# EAGLE design ADL5390board (EAGLE 9.6.2)
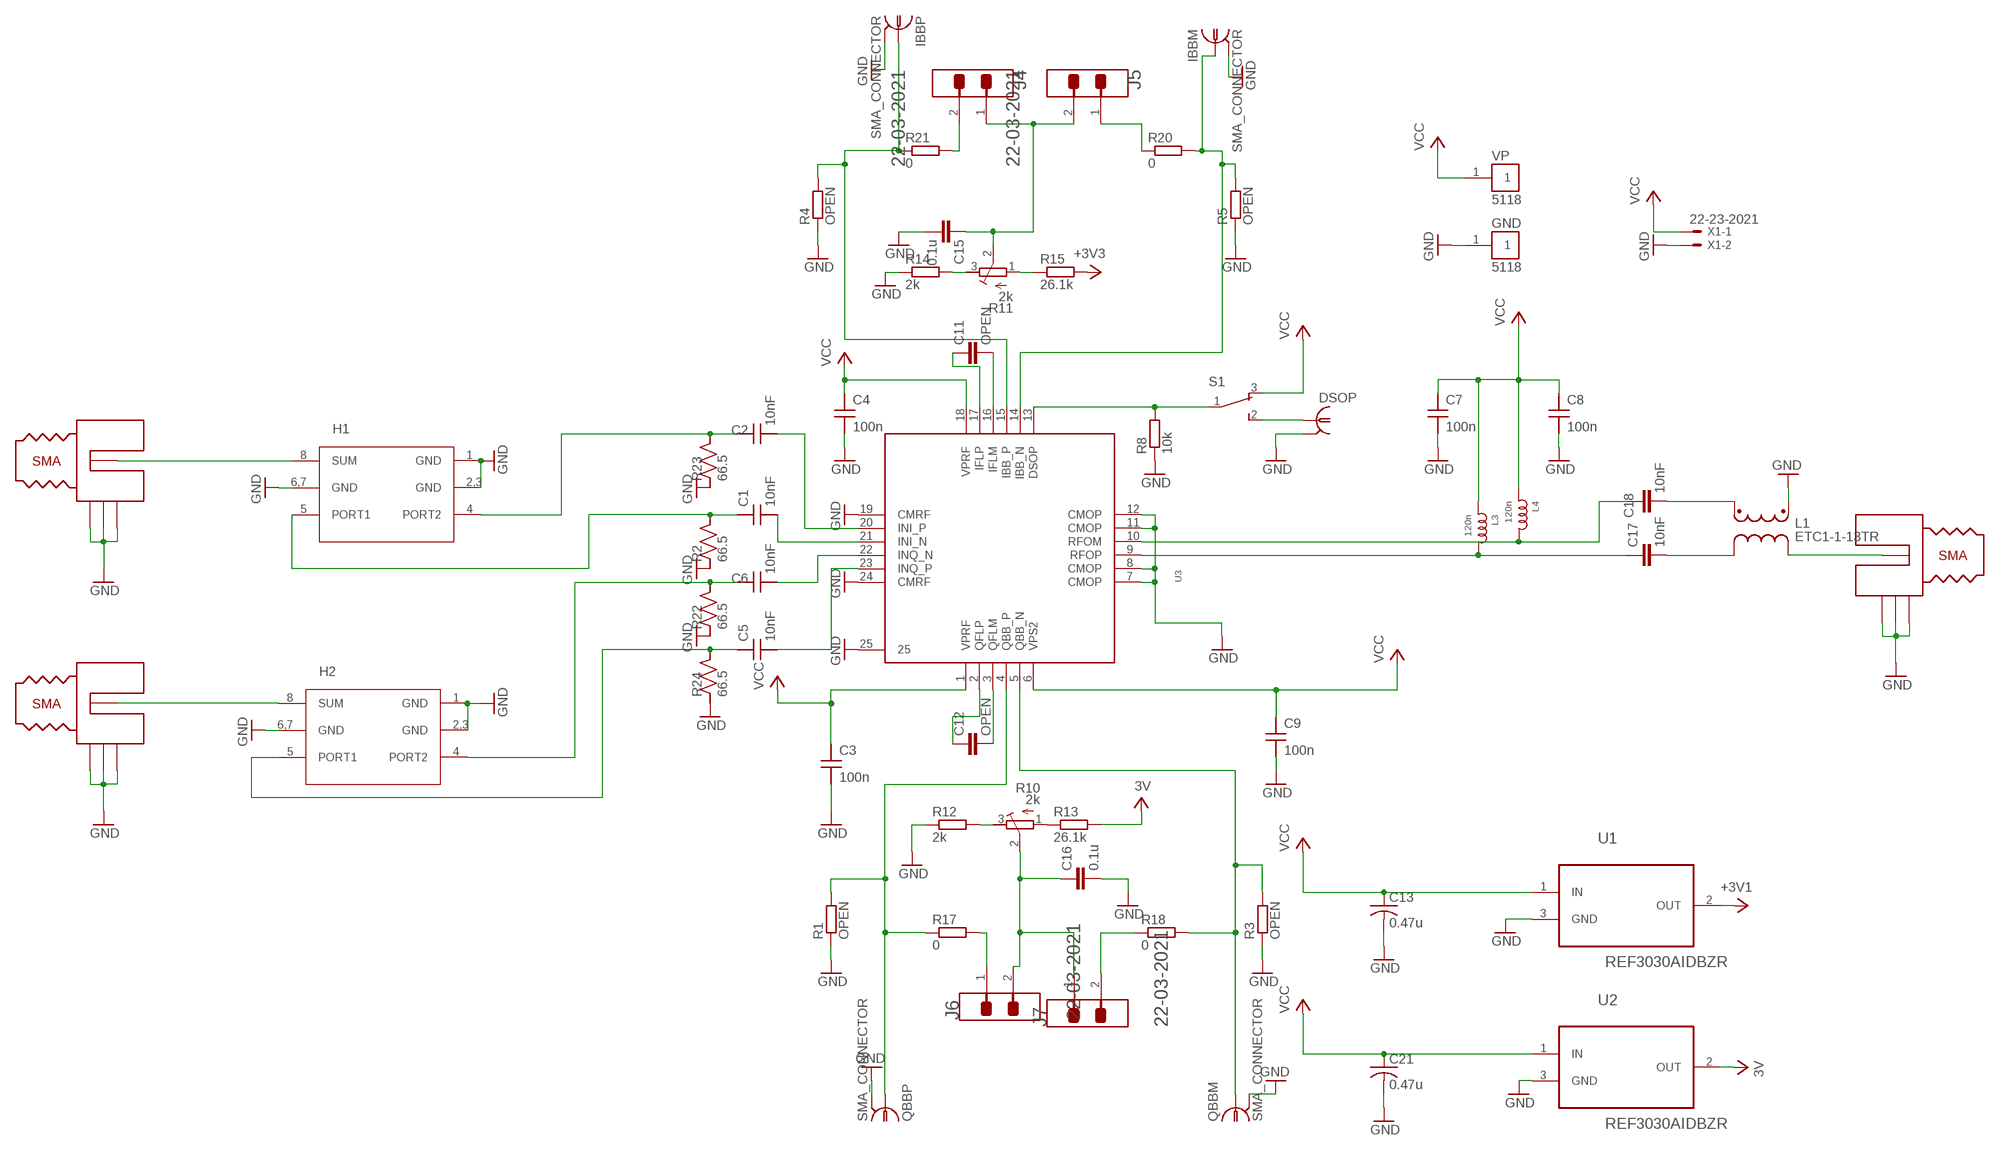
[diagram p0: schematic, sheet 1]

## Parts
C1  10nF  C_MLCC_SMDCMLCC_0402  [C_MLCC_0402]
C2  10nF  C_MLCC_SMDCMLCC_0402  [C_MLCC_0402]
C3  100n  C_MLCC_SMDCMLCC_0204  [C_MLCC_0204]
C4  100n  C_MLCC_SMDCMLCC_0204  [C_MLCC_0204]
C5  10nF  C_MLCC_SMDCMLCC_0402  [C_MLCC_0402]
C6  10nF  C_MLCC_SMDCMLCC_0402  [C_MLCC_0402]
C7  100n  C_MLCC_SMDCMLCC_0204  [C_MLCC_0204]
C8  100n  C_MLCC_SMDCMLCC_0204  [C_MLCC_0204]
C9  100n  C_MLCC_SMDCMLCC_0204  [C_MLCC_0204]
C11  OPEN  C-EUC0603  [C0603]
C12  OPEN  C-EUC0603  [C0603]
C13  0.47u  C-USC0603  [C0603]
C15  0.1u  C-EUC0603  [C0603]
C16  0.1u  C-EUC0603  [C0603]
C17  10nF  C-EUC0402  [C0402]
C18  10nF  C-EUC0402  [C0402]
C21  0.47u  C-USC0603  [C0603]
DSOP  SMA_CONNECTOR  [QKDLAB_JOSH_MECHANICAL_JOHNSON_SMA_EDGE_LAUNCH_142-0701-851]
GND  5118  [TP_5118]
H1  SYPJ-2-33+  [PL-274]
H2  SYPJ-2-33+  [PL-274]
IBBM  SMA_CONNECTOR  [QKDLAB_JOSH_MECHANICAL_JOHNSON_SMA_EDGE_LAUNCH_142-0701-851]
IBBP  SMA_CONNECTOR  [QKDLAB_JOSH_MECHANICAL_JOHNSON_SMA_EDGE_LAUNCH_142-0701-851]
J1  QKDLAB_JOSH_MECHANICAL_JOHNSON_SMA_18GHZ_142-0761-891  [QKDLAB_JOSH_MECHANICAL_JOHNSON_SMA_18GHZ_4-LAYER_142-0761-891]
J2  QKDLAB_JOSH_MECHANICAL_JOHNSON_SMA_18GHZ_142-0761-891  [QKDLAB_JOSH_MECHANICAL_JOHNSON_SMA_18GHZ_4-LAYER_142-0761-891]
J3  QKDLAB_JOSH_MECHANICAL_JOHNSON_SMA_18GHZ_142-0761-891  [QKDLAB_JOSH_MECHANICAL_JOHNSON_SMA_18GHZ_4-LAYER_142-0761-891]
J4  MOLEX_22-03-2021MOLEX_22-03-2021_0_0  [MOLEX_22-03-2021_0]
J5  MOLEX_22-03-2021MOLEX_22-03-2021_0_0  [MOLEX_22-03-2021_0]
J6  MOLEX_22-03-2021MOLEX_22-03-2021_0_0  [MOLEX_22-03-2021_0]
J7  MOLEX_22-03-2021MOLEX_22-03-2021_0_0  [MOLEX_22-03-2021_0]
L1  ETC1-1-13TR  [SM22]
L3  120n  L_0603  [R0603]
L4  120n  L_0603  [R0603]
QBBM  SMA_CONNECTOR  [QKDLAB_JOSH_MECHANICAL_JOHNSON_SMA_EDGE_LAUNCH_142-0701-851]
QBBP  SMA_CONNECTOR  [QKDLAB_JOSH_MECHANICAL_JOHNSON_SMA_EDGE_LAUNCH_142-0701-851]
R1  OPEN  R-EU_R0603  [R0603]
R2  66.5  R_SMDR0402  [R_0402]
R3  OPEN  R-EU_R0603  [R0603]
R4  OPEN  R-EU_R0603  [R0603]
R5  OPEN  R-EU_R0603  [R0603]
R8  10k  R-EU_R0603  [R0603]
R10  2k  R-TRIMM3296W  [RTRIM3296W]
R11  2k  R-TRIMM3296W  [RTRIM3296W]
R12  2k  R-EU_R0603  [R0603]
R13  26.1k  R-EU_R0603  [R0603]
R14  2k  R-EU_R0603  [R0603]
R15  26.1k  R-EU_R0603  [R0603]
R17  0  R-EU_R0603  [R0603]
R18  0  R-EU_R0603  [R0603]
R20  0  R-EU_R0603  [R0603]
R21  0  R-EU_R0603  [R0603]
R22  66.5  R_SMDR0402  [R_0402]
R23  66.5  R_SMDR0402  [R_0402]
R24  66.5  R_SMDR0402  [R_0402]
S1  450301014042  [450301014042]
U1  REF3030AIDBZR  [SOT95P237X112-3N]
U2  REF3030AIDBZR  [SOT95P237X112-3N]
U3  ADL5390_ADL5390  [ADL5390_ADL5390]
VP  5118  [TP_5118]
X1  22-23-2021  [22-23-2021]

## Nets
+3V3: R15.2 U1.2(OUT) ; supply symbol labelled +3V1
DSOP [CHIP_PIN]: R8.2 S1.1 U3.13(DSOP)
GND: C3.P$2 C4.P$2 C7.P$2 C8.P$2 C9.P$2 C13.2 C15.2 C16.2 C21.2 DSOP.P$2 DSOP.P$3 DSOP.P$4 DSOP.P$5 GND.1 H1.1(GND) H1.2,3(GND) H1.6,7(GND) H2.1(GND) H2.2,3(GND) H2.6,7(GND) IBBM.P$2 IBBM.P$3 IBBM.P$4 IBBM.P$5 IBBP.P$2 IBBP.P$3 IBBP.P$4 IBBP.P$5 J1.P$2(GND) J1.P$3(GND) J1.P$4(GND) J2.P$2(GND) J2.P$3(GND) J2.P$4(GND) J3.P$2(GND) J3.P$3(GND) J3.P$4(GND) L1.1 QBBM.P$2 QBBM.P$3 QBBM.P$4 QBBM.P$5 QBBP.P$2 QBBP.P$3 QBBP.P$4 QBBP.P$5 R1.1 R2.P$1 R3.1 R4.1 R5.1 R8.1 R12.1 R14.1 R22.P$1 R23.P$1 R24.P$1 U1.3(GND) U2.3(GND) U3.7(CMOP) U3.8(CMOP) U3.11(CMOP) U3.12(CMOP) U3.19(CMRF) U3.24(CMRF) U3.25 X1.2
IBB_N [CHIP_PIN]: IBBM.P$1 R5.2 R20.2 U3.14(IBB_N)
IBB_P [CHIP_PIN]: IBBP.P$1 R4.2 R21.1 U3.15(IBB_P)
IFL_N [CHIP_PIN]: C11.2 U3.16(IFLM)
IFL_P [CHIP_PIN]: C11.1 U3.17(IFLP)
IN_N: H2.8(SUM) J2.P$1(SIG)
IN_P: H1.8(SUM) J1.P$1(SIG)
INI_N [CHIP_PIN]: C1.P$2 U3.21(INI_N)
INI_P [CHIP_PIN]: C2.P$2 U3.20(INI_P)
INQ_N [CHIP_PIN]: C6.P$2 U3.22(INQ_N)
INQ_P [CHIP_PIN]: C5.P$2 U3.23(INQ_P)
N$1: R11.1(A) R15.1
N$2: R11.3(E) R14.2
N$3: C15.1 J4.1 J5.2 R11.2(S)
N$5: J4.2 R21.2
N$8: J5.1 R20.1
N$9: J6.1 R17.2
N$11: J7.2 R18.1
N$13: C16.1 J6.2 J7.1 R10.2(S)
N$15: R10.3(E) R12.2
N$16: R10.1(A) R13.1
N$20: C18.2 L1.5
N$21: C17.2 L1.4
N$22: J3.P$1(SIG) L1.3
N$24: DSOP.P$1 S1.2
QBB_N [CHIP_PIN]: QBBM.P$1 R3.2 R18.2 U3.5(QBB_N)
QBB_P [CHIP_PIN]: QBBP.P$1 R1.2 R17.1 U3.4(QBB_P)
QFL_N [CHIP_PIN]: C12.2 U3.3(QFLM)
QFL_P [CHIP_PIN]: C12.1 U3.2(QFLP)
RFINI_N [Differential]: C1.P$1 H1.5(PORT1) R2.P$2
RFINI_P [Differential]: C2.P$1 H1.4(PORT2) R23.P$2
RFINQ_N [Differential]: C6.P$1 H2.4(PORT2) R22.P$2
RFINQ_P [Differential]: C5.P$1 H2.5(PORT1) R24.P$2
RFO_N [RFOUT]: C18.1 L4.2 U3.10(RFOM)
RFO_P [RFOUT]: C17.1 L3.2 U3.9(RFOP)
V+: R13.2 U2.2(OUT) ; supply symbol labelled 3V
VCC: C3.P$1 C4.P$1 C7.P$1 C8.P$1 C9.P$1 C13.1 C21.1 L3.1 L4.1 S1.3 U1.1(IN) U2.1(IN) U3.1(VPRF) U3.6(VPS2) U3.18(VPRF) VP.1 X1.1

## Library data of the parts
C1 C2 C5 C6 = jqi_passives:C_MLCC_SMD; DIGIKEY: 445-6846-1-ND; PARTNO: C1005C0G1H102J050BA
C3 C4 C7-C9 = jqi_passives:C_MLCC_SMD; DIGIKEY: 587-5138-1-ND; PARTNO: EWK105C6104MPHF
C11 C12 = rcl:C-EU: CAPACITOR, European symbol; SPICEPREFIX: C
C13 C21 = rcl:C-US: CAPACITOR, American symbol; DIGIKEY: 1276-2082-1-ND; PARTNO: CL10B474KA8NFNC; SPICEPREFIX: C
C15 C16 = rcl:C-EU: CAPACITOR, European symbol; DIGIKEY: 1276-1006-1-ND; PARTNO: CL10B104KA8NNNC; SPICEPREFIX: C
C17 C18 = rcl:C-EU: CAPACITOR, European symbol; DIGIKEY: 445-6846-1-ND; PARTNO: C1005C0G1H102J050BA; SPICEPREFIX: C
DSOP = SMA_connectors:SMA_CONNECTOR
GND = 5118:5118: Gray PC Test Point, Miniature Phosphor Bronze, Silver Plating 0.040" (1.02mm) Hole Diameter Mounting Type Check prices <https://pricing.snapeda.com/search/part/5118/?ref=eda>; AVAILABILITY: Warning; DESCRIPTION: 18µH Shielded Wirewound Inductor 7.5A 22mOhm Nonstandard; DIGIKEY: 36-5118-ND; MF: Keystone Electronics; MP: 5118; PACKAGE: Package; PARTNO: 5118; PRICE: None; PURCHASE-URL: https://pricing.snapeda.com/search/part/5118/?ref=eda
H1 H2 = MiniCircuits_TTC:SYPJ-2-33+
IBBM IBBP QBBM QBBP = SMA_connectors:SMA_CONNECTOR; DIGIKEY: J658-ND
J1-J3 = SMA_connectors:QKDLAB_JOSH_MECHANICAL_JOHNSON_SMA_18GHZ_142-0761-891: Emerson 142-0761-891 High Frequency SMA End Launch Connector; DIGIKEY: ARF2499-ND; PARTNO: 901-10511-2
J4-J7 = Molex - 22-03-2021:MOLEX_22-03-2021: KK® 254 Wire-to-Board Header, Single Row, Vertical, 2 Circuits, PA Polyamide Nylon, Tin (Sn) Plating; CENTROID_NOT_SPECIFIED: No; CONTACT_TYPE: Male Pin; DATASHEET: http://www.molex.com/pdm_docs/sd/022032021_sd.pdf; DIGIKEY_DESCRIPTION: CONN HEADER 2POS .100 VERT TIN; DIGIKEY_PART_NUMBER: WM4000-ND; LEAD_FREE: yes; MF: Molex; MOUSER_PART_NUMBER: 538-22-03-2021; MPN: 22-03-2021; NUMBER_OF_POSITIONS: 2; NUMBER_OF_ROWS: 1; PACKAGE: HDR2; PITCH_-_MATING: 0.100" (2.54mm); PREFIX: J; ROHS: yes; TEMPERATURE_RANGE_HIGH: +80°C; TEMPERATURE_RANGE_LOW: -40°C; VOLTAGE: 250V
L1 = ETC1-1-13TR:ETC1-1-13TR: RF 1:1 Transmission Line Transformer 4.5 - 3000 MHz; AVAILABILITY: Unavailable; DESCRIPTION: RF Balun 4.5MHz ~ 3GHz 1:1 5-SMD; DIGIKEY: 1465-1217-1-ND; MF: M/A-Com Technology; MP: ETC1-1-13TR; PACKAGE: SMD-5 MA-COM; PRICE: None
L3 L4 = Inductor_TC:L_0603; DIGIKEY: 490-LQW18ASR12G0CDCT-ND; PARTNO: LQW18ASR12G0CD
R1 R3-R5 R17 R18 R20 R21 = rcl:R-EU_: RESISTOR, European symbol; DIGIKEY: 541-0.0GCT-ND; PARTNO: CRCW06030000Z0EA; SPICEPREFIX: R
R2 R22-R24 = jqi_passives:R_SMD; DIGIKEY: P66.5LDKR-ND; PARTNO: ERJ-2RKF66R5X
R8 = rcl:R-EU_: RESISTOR, European symbol; DIGIKEY: P10KDBCT-ND; PARTNO: ERA-3AEB103V; SPICEPREFIX: R
R10 R11 = rcl:R-TRIMM: Trimm resistor; DIGIKEY: 490-2880-ND; PARTNO: PV36W202C01B00; SPICEMODEL: X; SPICEPREFIXL: POT
R12 R14 = rcl:R-EU_: RESISTOR, European symbol; DIGIKEY: P2.0KDBCT-ND; PARTNO: ERA-3AEB202V; SPICEPREFIX: R
R13 R15 = rcl:R-EU_: RESISTOR, European symbol; DIGIKEY: P26.1KDBCT-ND; PARTNO: ERA-3AEB2612V; SPICEPREFIX: R
S1 = 450301014042:450301014042: 10x2.5 mm THT WS-SLTV <http://katalog.we-online.de/media/images/v2/Family_WS-SLTV_THT_Mini_Slide_Switch_450301014042.jpg> Details see: http://katalog.we-online.de/en/em/SLTV_10X2_5_THT 2015 (C) Wurth Elektronik Check prices <https://pricing.snapeda.com/search/part/450301014042/?ref=eda>; AVAILABILITY: Warning; DESCRIPTION: Slide Switch SPDT Through Hole; DIGIKEY: 450301014042-ND; MF: Wurth Electronics; MP: 450301014042; PACKAGE: None; PRICE: None; PURCHASE-URL: https://pricing.snapeda.com/search/part/450301014042/?ref=eda
U1 U2 = REF3030AIDBZR:REF3030AIDBZR: CMOS VOLTAGE REFERENCE; DESCRIPTION: 3-V, 50-ppm/C, 50-A in 3-pin SOT-23 package series (bandgap) voltage reference 3-SOT-23 -40 to 125; DIGI-KEY_PART_NUMBER: 296-26323-1-ND; MF: Texas Instruments; MP: REF3030AIDBZR; PACKAGE: SOT-23-3 Texas Instruments; PURCHASE-URL: https://pricing.snapeda.com/search/part/REF3030AIDBZR/?ref=eda
U3 = ADL5390board:ADL5390_ADL5390; DIGIKEY: ADL5390ACPZ-REEL7CT-ND; PARTNO: ADL5390ACPZ-REEL7
VP = 5118:5118: Gray PC Test Point, Miniature Phosphor Bronze, Silver Plating 0.040" (1.02mm) Hole Diameter Mounting Type Check prices <https://pricing.snapeda.com/search/part/5118/?ref=eda>; AVAILABILITY: Warning; DESCRIPTION: 18µH Shielded Wirewound Inductor 7.5A 22mOhm Nonstandard; DIGIKEY: 36-5000-ND; MF: Keystone Electronics; MP: 5118; PACKAGE: Package; PARTNO: 5000; PRICE: None; PURCHASE-URL: https://pricing.snapeda.com/search/part/5118/?ref=eda
X1 = con-molex:22-23-2021: .100" (2.54mm) Center Header - 2 Pin; MF: MOLEX; MPN: 22-23-2021; OC_FARNELL: 1462926; OC_NEWARK: 25C3832

## Net classes
0 default: width 0.127 mm, clearance 0.152 mm
1 Differential: width 0.127 mm, drill 0.254 mm, clearance 0.254 mm to class 0, clearance 0.127 mm
2 CHIP_PIN: clearance 0.254 mm to class 0, clearance 0.127 mm to class 1, clearance 0.127 mm
3 RFOUT: clearance 0.127 mm to class 0, clearance 0.127 mm to class 1, clearance 0.127 mm to class 2, clearance 0.254 mm

## Board
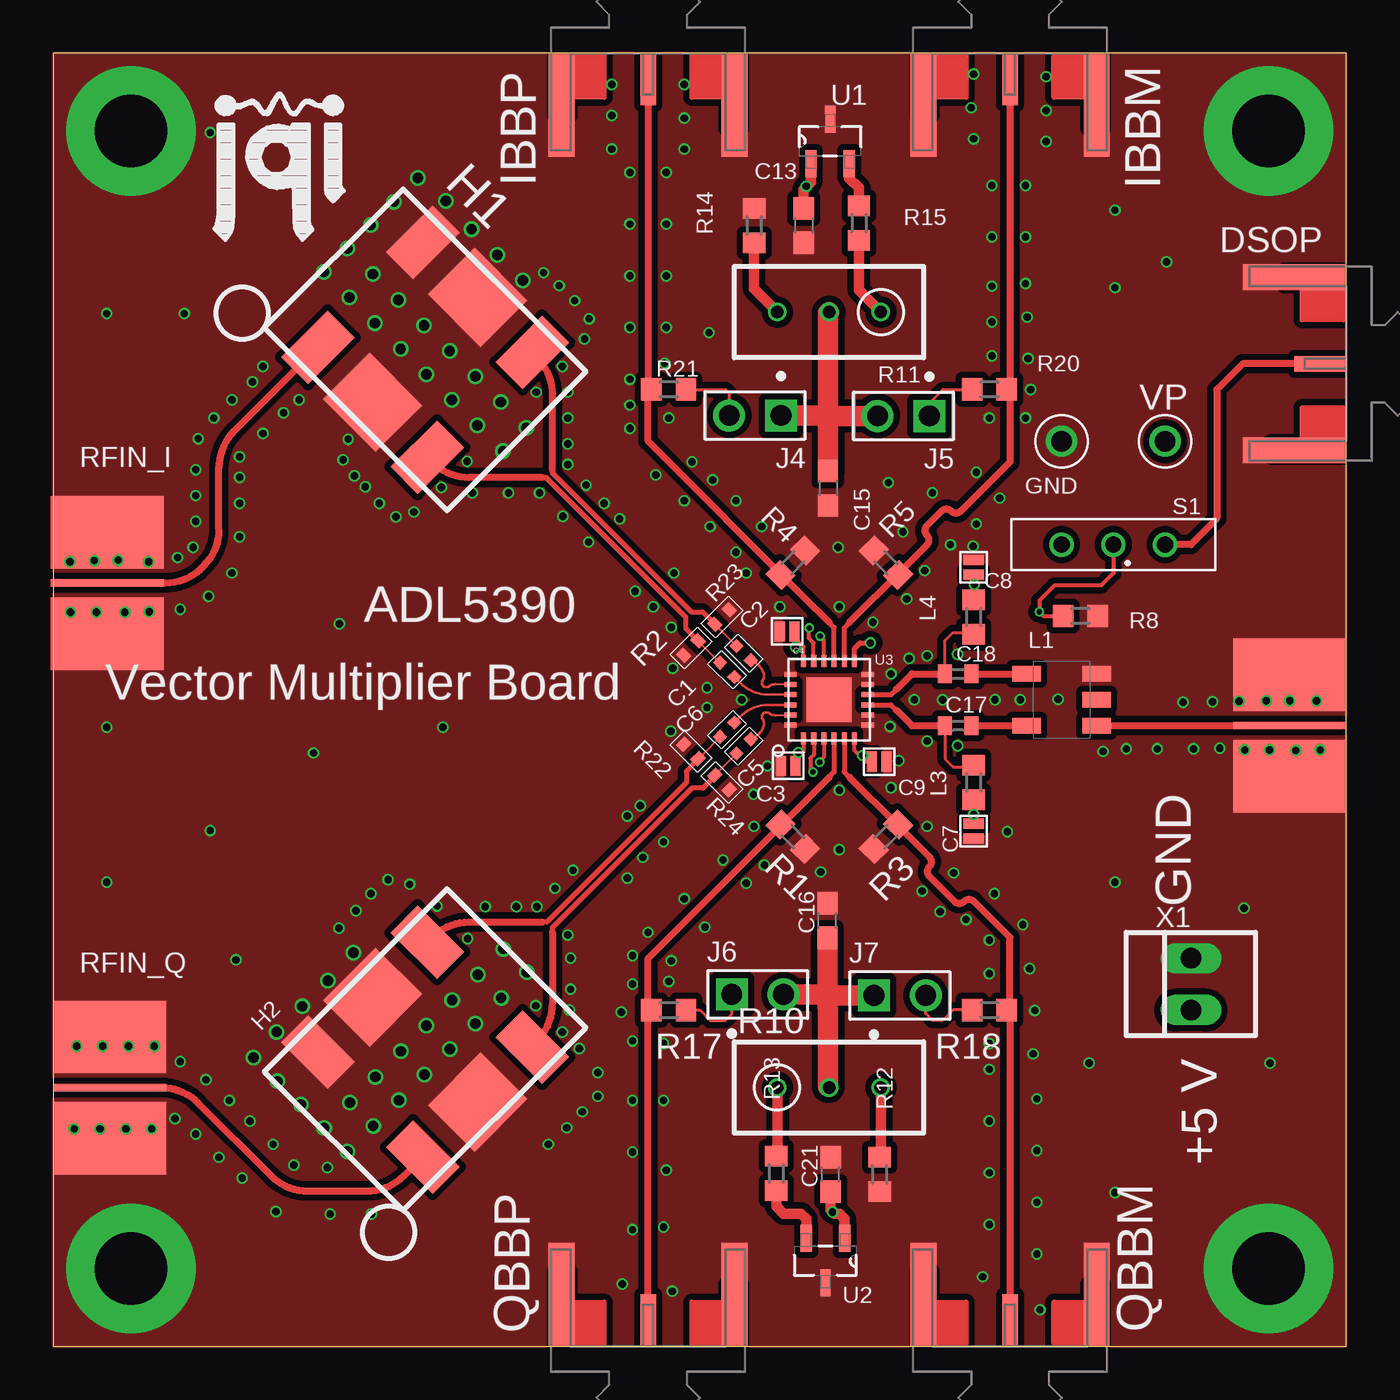
[diagram p1: board, top side]
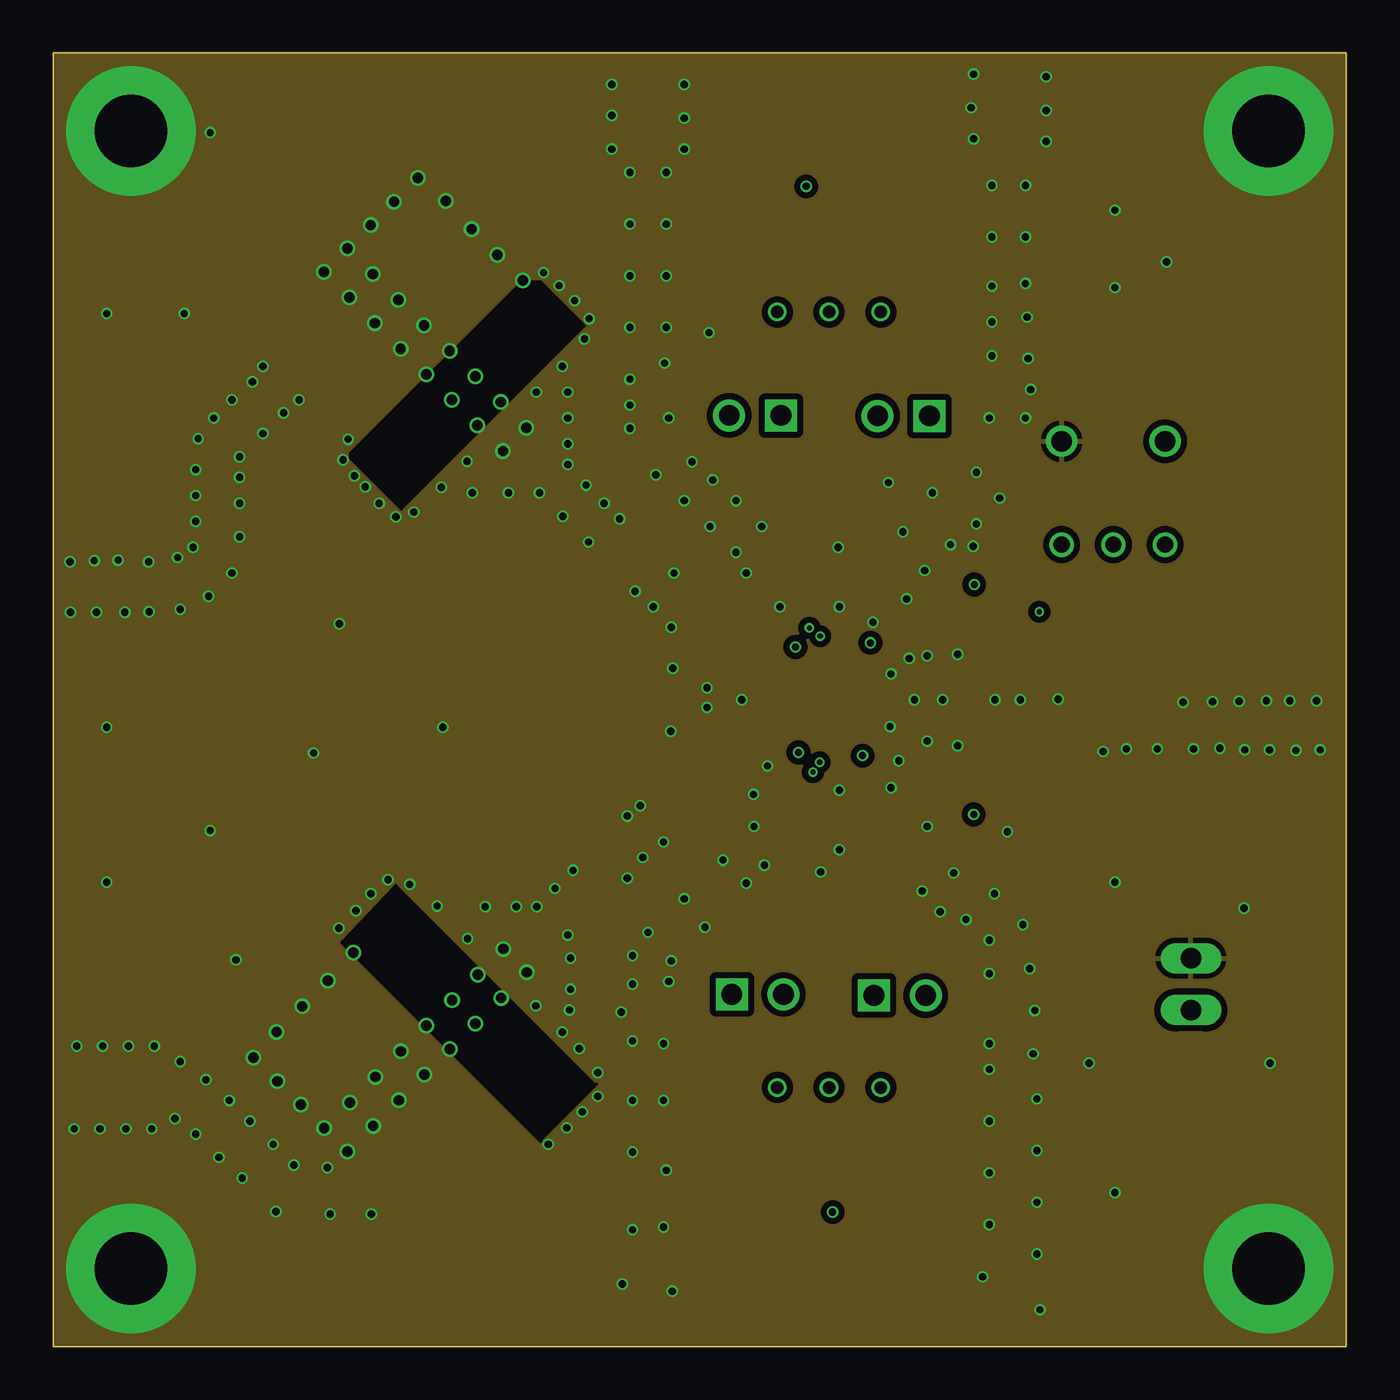
[diagram p2: board, inner layer Route2]
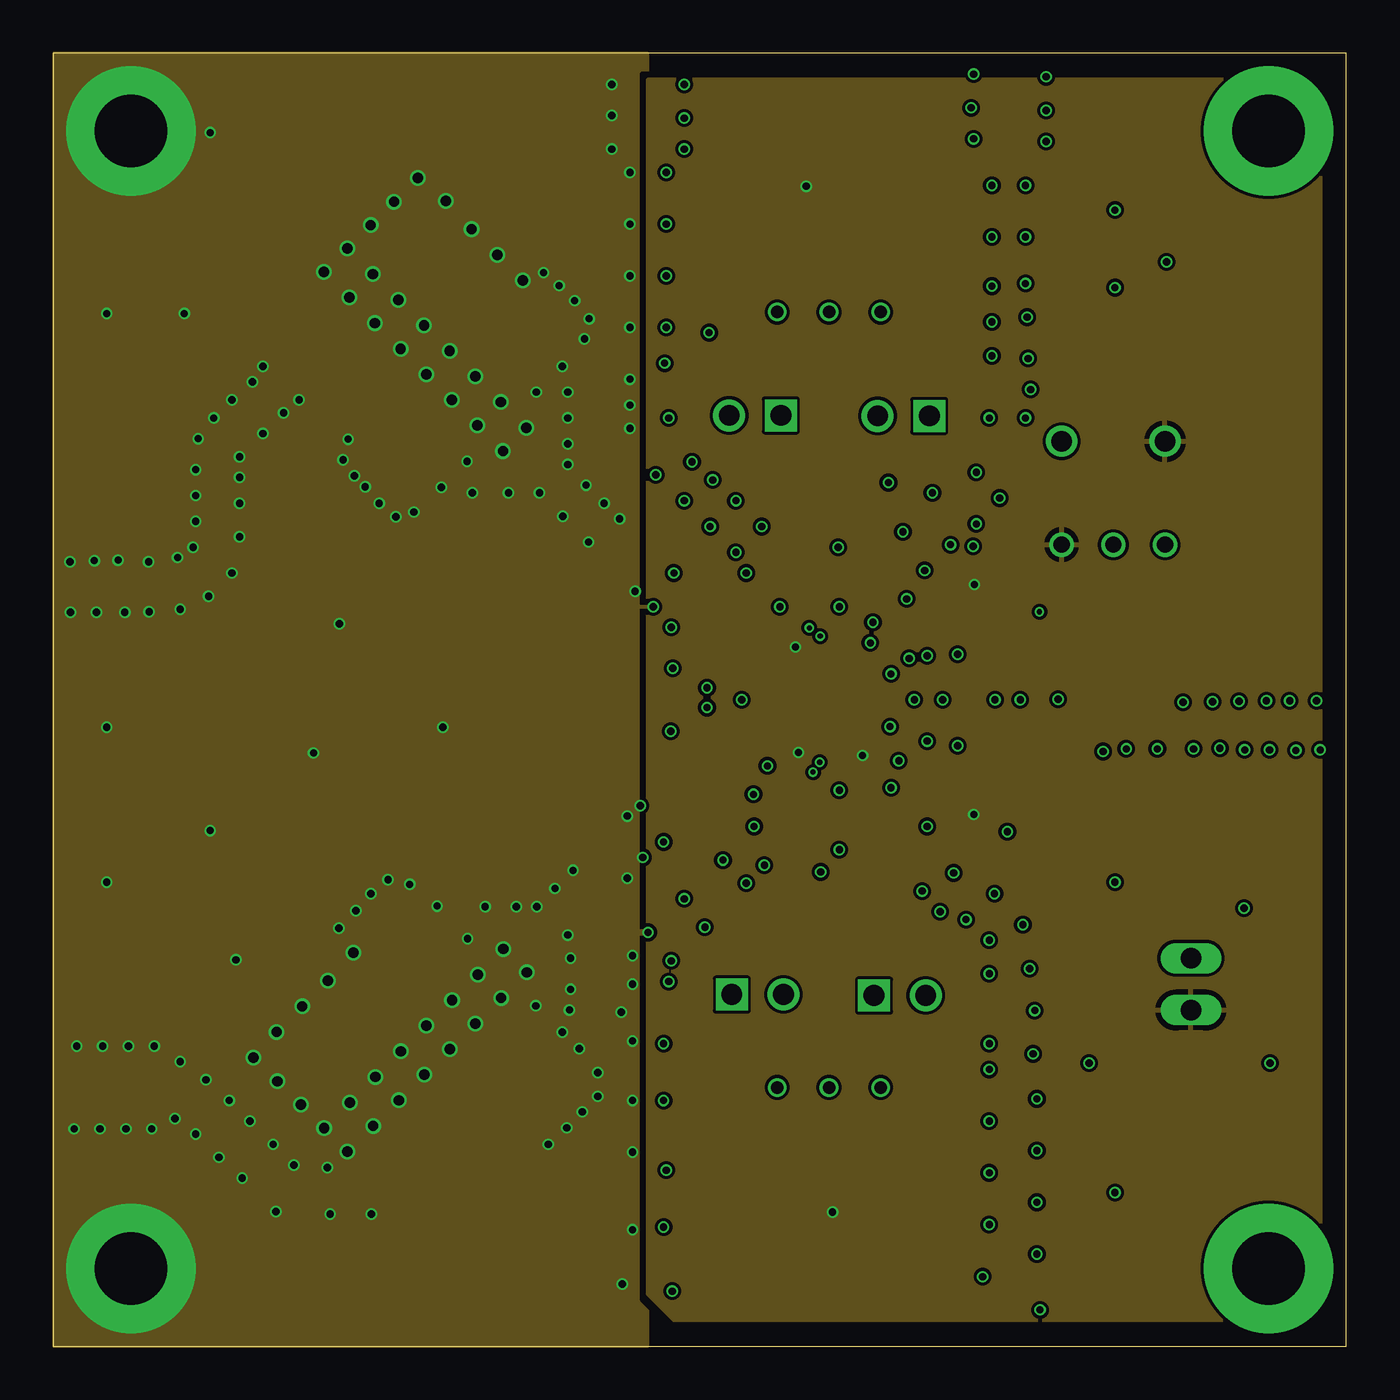
[diagram p3: board, inner layer Route15]
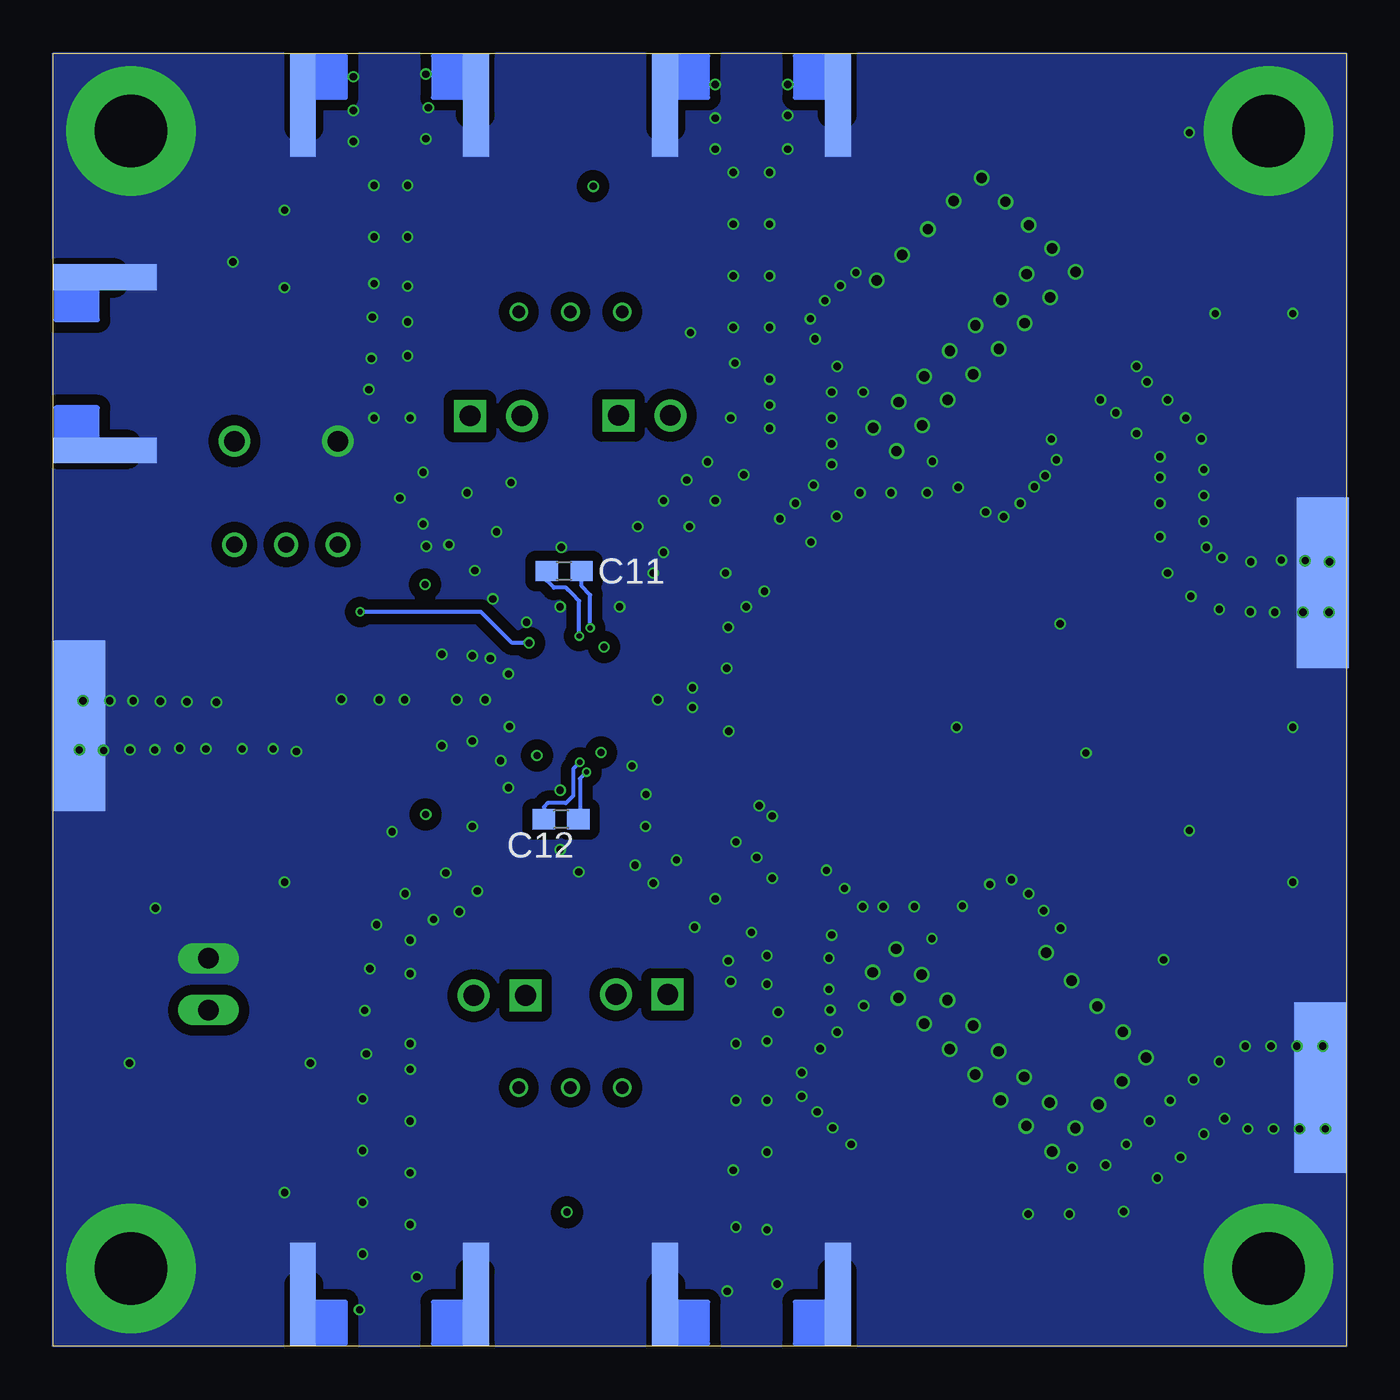
[diagram p4: board, bottom side, seen from below]

Size 63.5 x 63.5 mm. Coordinates in mm from the lower left corner, seen from the top.
Outline: 0,0 63.5,0 63.5,63.5 0,63.5 0,0
Copper layers (1*2*15*16): Top 0.035559375mm / dielectric 0.17018125mm / Route2 0.01778125mm / dielectric 47mil / Route15 0.01778125mm / dielectric 0.17018125mm / Bottom 0.035559375mm
Design rules "OSHPark_4layers *": minimum track width 5mil, minimum drill 10mil, track to track 5mil, track to pad 5mil, pad to pad 5mil, via to via 5mil, smd to smd 5mil, copper to edge 0mil, drill to drill 6mil, minimum pad ring 4mil, minimum via ring 4mil, stop-mask expansion 1.5mil, vias tented up to drill 14mil, thermal gap 10mil

### Footprints (pad centres in the part's own frame; a part is rotated, then mirrored left to right if it is on the bottom)
C_MLCC_0402 = smd 0.5 x 0.5: P$1 -0.5,0; P$2 0.5,0
C_MLCC_0204 = smd 0.5 x 1: P$1 -0.36,0; P$2 0.36,0
C0603 = smd 1.1 x 1: 1 -0.85,0; 2 0.85,0
C0402 = smd 0.7 x 0.9: 1 -0.65,0; 2 0.65,0
QKDLAB_JOSH_MECHANICAL_JOHNSON_SMA_EDGE_LAUNCH_142-0701-851 = smd 2.54 x 0.762: P$1 -1.27,0 | smd 5.08 x 1.27: P$2 -2.54,4.255; P$3 -2.54,-4.255 | smd 5.08 x 1.27 bottom: P$4 -2.54,4.255; P$5 -2.54,-4.255
TP_5118 = drill 1.02: 1 0,0
PL-274 = smd 1.88 x 3.226: 1 -3.81,3.644; 4 3.81,3.644; 5 3.81,-3.644; 8 -3.81,-3.644 | smd 3.658 x 3.226: 2,3 0,3.644; 6,7 0,-3.644
QKDLAB_JOSH_MECHANICAL_JOHNSON_SMA_18GHZ_4-LAYER_142-0761-891 = smd 0.356 x 5.537: P$1 0,-2.769 | smd 3.556 x 5.537: P$2 2.489,-2.769; P$3 -2.489,-2.769 | smd 8.382 x 2.54 bottom: P$4 0,-1.27
MOLEX_22-03-2021_0 = drill 1.02 pad 1.57 square: 1 -1.27,0 | drill 1.02 pad 1.57: 2 1.27,0
SM22 = smd 0.762 x 1.397: 1 -1.27,1.714; 2 0,1.714; 3 1.27,1.714; 4 1.27,-1.714; 5 -1.27,-1.714
R0603 = smd 1 x 1.1: 1 -0.85,0; 2 0.85,0
R_0402 = smd 0.5 x 0.6: P$1 -0.5,0; P$2 0.5,0
RTRIM3296W = drill 0.61: 1 0,-2.54; 2 0,0; 3 0,2.54
450301014042 = drill 0.8: 1 0,0; 2 -2.54,0; 3 2.54,0
SOT95P237X112-3N = smd 1.321 x 0.559: 1 -1.092,0.94; 2 -1.092,-0.94 | smd 1.321 x 0.508: 3 1.092,0
ADL5390_ADL5390 = smd 0.6 x 0.25: 1 -1.9,1.25; 2 -1.9,0.75; 3 -1.9,0.25; 4 -1.9,-0.25; 5 -1.9,-0.75; 6 -1.9,-1.25; 13 1.9,-1.25; 14 1.9,-0.75; 15 1.9,-0.25; 16 1.9,0.25; 17 1.9,0.75; 18 1.9,1.25 | smd 0.25 x 0.6: 7 -1.25,-1.9; 8 -0.75,-1.9; 9 -0.25,-1.9; 10 0.25,-1.9; 11 0.75,-1.9; 12 1.25,-1.9; 19 1.25,1.9; 20 0.75,1.9; 21 0.25,1.9; 22 -0.25,1.9; 23 -0.75,1.9; 24 -1.25,1.9 | smd 2.2 x 2.2: 25 0,0
22-23-2021 = drill 1 long: 1 -1.27,0; 2 1.27,0

### Placement (x,y rotation side)
C1  33.1,33.22 315 top
C2  33.91,34.04 315 top
C3  36.09,28.5 180 top
C4  36.04,35.1 180 top
C5  33.91,29.46 45 top
C6  33.1,30.28 45 top
C7  45.21,25.3 270 top
C8  45.21,38.25 90 top
C9  40.56,28.7 0 top
C11  38.4,38.07 180 bottom
C12  38.56,25.88 180 bottom
C13  36.86,55.04 270 top
C15  38.05,42.14 270 top
C16  38.02,20.9 90 top
C17  44.45,30.48 0 top
C18  44.45,33.02 0 top
C21  38.18,8.43 90 top
DSOP  63.5,48.26 0 top
GND  49.53,44.45 0 top
H1  18.26,48.94 315 top
H2  18.26,14.56 45 top
IBBM  46.99,63.5 90 top
IBBP  29.21,63.5 90 top
J1  -0.13,37.49 90 top
J2  0,12.7 90 top
J3  63.5,30.48 270 top
J4  34.47,45.72 180 top
J5  41.76,45.69 180 top
J6  34.59,17.27 0 top
J7  41.58,17.22 0 top
L1  49.53,31.75 270 top
L3  45.21,27.69 90 top
L4  45.21,35.81 270 top
QBBM  46.99,0 270 top
QBBP  29.21,0 270 top
R1  36.32,25.02 135 top
R2  31.32,34.29 45 top
R3  40.89,25.02 45 top
R4  36.32,38.48 225 top
R5  40.89,38.48 315 top
R8  50.44,35.86 180 top
R10  38.1,12.7 270 top
R11  38.1,50.8 90 top
R12  40.59,8.43 90 top
R13  35.51,8.48 270 top
R14  34.42,55.04 270 top
R15  39.57,55.17 90 top
R17  30.23,16.51 0 top
R18  45.97,16.51 0 top
R20  45.97,46.99 0 top
R21  30.23,46.99 0 top
R22  31.32,29.21 315 top
R23  32.84,35.81 225 top
R24  32.84,27.69 135 top
S1  52.07,39.37 180 top
U1  38.15,59.18 90 top
U2  37.92,4.19 270 top
U3  38.1,31.75 90 top
U$4  [JQI_LOGO_POSITIVE-SILKSCREEN]  7.62,54.61 0 top
VP  54.61,44.45 0 top
X1  55.88,17.78 90 top

### Tracks (layer width: path | path; a pad name or v marks a point on that pad's centre or on a via)
+3V3
  Top 0.508: U1.2 39.09,57.38 39.57,56.9 R15.2
DSOP  (via drill 0.25, 0.35)
  Top 0.203: 48.64,35.87 v48.44,36.07 48.44,36.63 49.17,37.36 51.46,37.36 52.07,37.97 S1.1 | 48.64,35.87 R8.2 48.64,35.87
  Top 0.254: U3.13 39.35,34.27 39.62,34.54 v40.13,34.54
  Bottom 0.203: v40.13,34.54 40.97,34.54 42.49,36.07 v48.44,36.07
GND  (via drill 0.36, 0.51, 3.56 pad 6.35)
  other vias: 19.46,48.89 20.72,47.63 21.98,46.37 23.23,45.12 18.31,47.74 19.57,46.48 20.83,45.22 22.08,43.97 18.2,50.14 16.95,51.4 15.69,52.66 14.43,53.92 17.05,49 15.8,50.25 14.54,51.51 13.28,52.77 15.58,55.07 16.73,56.22 17.9,57.38 19.28,56.25 20.54,54.87 21.8,53.61 23.05,52.35 13.3,10.71 14.55,11.96 15.81,13.22 17.07,14.48 18.33,15.74 19.58,16.99 20.84,18.25 22.1,19.51 14.45,9.56 15.7,10.81 16.96,12.07 18.22,13.33 19.48,14.59 20.73,15.84 21.99,17.1 23.25,18.36 12.15,11.86 11,13.01 9.83,14.17 10.96,15.43 12.22,16.69 13.48,17.94 14.73,19.33 1.14,14.73 2.41,14.73 3.68,14.73 4.95,14.73 6.22,13.97 7.49,13.08 8.64,12.06 9.65,11.05 10.79,9.91 11.81,8.89 13.46,8.76 1.02,10.67 2.29,10.67 3.56,10.67 4.83,10.67 5.97,11.18 6.99,10.41 8.13,9.27 9.27,8.26 10.92,6.6 13.59,6.48 15.62,6.48 24.99,15.42 25.4,17.53 25.4,19.05 25.27,20.19 23.75,21.59 22.73,21.59 21.21,21.59 24.64,22.48 25.53,23.37 0.84,36.04 2.11,36.04 3.51,36.04 4.7,36.07 2.62,30.4 6.22,36.2 7.62,36.83 8.76,37.97 9.14,39.75 9.14,41.4 9.14,42.67 9.14,43.69 10.29,44.83 11.3,45.85 12.06,46.48 0.81,38.53 2.01,38.58 3.17,38.61 4.67,38.53 6.1,38.73 6.86,39.24 6.99,40.51 6.99,41.78 6.99,43.05 7.11,44.58 7.87,45.59 8.76,46.48 9.78,47.37 10.29,48.13 19.05,42.19 20.57,41.91 22.35,41.91 23.88,41.91 25.02,40.77 26.29,39.5 24.99,48.13 25.27,46.86 25.27,45.59 25.27,44.32 25.27,43.31 26.16,42.29 27.05,41.4 27.81,40.64 30.48,37.97 30.35,35.31 28.32,57.66 28.32,55.12 28.32,52.58 28.32,50.04 28.32,47.5 28.32,46.23 28.32,45.09 29.59,42.8 30.99,41.53 38.61,36.32 32.38,42.55 31.37,43.43 30.23,45.59 40.26,35.56 43.18,41.91 45.34,40.39 46.48,41.66 45.34,42.93 45.97,45.59 47.75,45.59 48.01,46.99 47.88,48.51 47.83,50.55 47.75,52.2 47.75,54.48 47.75,57.02 46.1,57.02 46.1,54.48 30.1,57.66 30.1,55.12 30.1,52.58 30.1,50.04 30.02,48.29 46.1,52.07 46.1,50.32 46.1,48.64 27.43,58.8 27.43,60.45 27.43,61.98 30.99,58.8 30.99,60.33 30.99,61.98 45.21,59.31 45.09,60.83 45.21,62.48 48.77,59.18 48.77,60.71 48.77,62.36 41.15,33.02 42.04,33.78 42.93,33.91 42.29,31.75 43.69,31.75 41.1,30.43 42.93,29.72 51.56,29.21 52.7,29.34 54.23,29.34 56.01,29.34 55.5,31.62 56.95,31.65 57.3,29.36 58.52,29.29 59.74,29.29 61.04,29.26 58.24,31.67 59.59,31.7 60.73,31.7 28.45,5.71 28.45,9.53 28.45,14.99 27.89,16.41 28.45,17.78 28.45,19.18 29.21,20.32 28.19,22.99 28.96,24 29.97,24.77 28.19,26.04 28.83,26.54 28.57,37.08 29.46,36.32 29.97,12.06 29.97,14.86 30.1,8.64 29.97,5.84 30.23,17.91 30.35,18.92 32,20.57 30.99,21.97 34.04,22.73 34.92,23.62 32.89,23.88 34.42,25.53 37.69,23.29 38.61,27.3 41.15,27.43 42.67,22.35 43.56,21.34 44.83,20.95 45.97,19.94 45.97,18.29 46.86,25.27 42.93,25.53 46.23,22.23 47.62,20.7 47.96,18.54 48.21,16.48 48.13,14.35 48.31,12.14 48.31,9.6 48.31,7.06 48.31,4.52 45.97,14.86 45.97,13.59 45.97,11.05 45.97,8.51 45.97,5.97 62.05,31.7 62.23,29.29 2.62,22.78 12.78,29.13 7.7,25.32 14.05,35.48 19.13,30.4 8.97,18.97 6.43,50.72 2.62,50.72 7.7,59.61 52.15,51.99 52.15,55.8 54.69,53.26 52.15,22.78 59.77,13.89 50.88,13.89 58.5,21.51 33.81,31.75 32.11,32.33 32.11,31.37 30.43,33.3 30.33,30.2 34.39,27.1 46.25,31.75 47.5,31.75 49.35,31.78 44.22,23.24 45.19,39.29 41.53,28.75 35.08,28.5 32.26,40.26 33.53,38.99 34.04,37.97 35.69,36.32 41.02,42.42 34.8,40.26 33.53,41.53 32.21,49.78 41.73,40.01 41.91,36.7 42.8,38.1 44.07,39.37 28.45,12.06 18.85,21.62 17.5,22.68 16.43,22.91 15.6,22.23 14.86,21.39 14.02,20.52 24.31,9.91 25.22,10.72 25.98,11.51 26.75,12.27 26.75,13.44 25.83,14.61 25.35,16.51 14.48,44.55 14.22,43.54 14.78,42.75 15.32,42.21 16,41.4 16.81,40.74 17.7,40.97 24.08,52.73 24.84,52.1 25.6,51.36 26.31,50.47 26.09,49.48 44.42,33.99 44.42,29.49 45.64,3.4 27.94,3.05 30.4,2.69 48.46,1.78 20.32,43.46 23.72,46.86 20.35,20.02 23.7,16.71 3.81,59.69 59.69,59.69 3.81,3.81 59.69,3.81 52.15,7.54 38.61,24.38 38.56,39.24
  pour Top (isolate 0.305, no thermals): 0,63.5 0,0 63.5,0 63.5,63.5
  pour Bottom (isolate 0.508, rank 2, no thermals): 0,63.5 0,0 63.5,0 63.5,63.5
  pour Route2 (isolate 0.305): 0,63.5 0,0 63.5,0 63.5,63.5
  pour Route15 (isolate 0.305, rank 2): 0,63.5 0,0 29.21,0 29.21,63.5
IBB_N
  Top 0.254: U3.14 38.85,35.29 39.12,35.56
  Top 0.356: IBBM.P$1 46.99,46.99 | 46.99,46.99 46.99,43.43 44.58,41.02 arc-90 44.1,41.02 arc90 43.62,41.02 42.91,40.31 arc90 42.91,39.83 arc-90 42.91,39.35 41.66,38.1 | 39.12,35.56 41.66,38.1 | R20.2 46.99,46.99 | R5.2 41.66,38.04 41.66,38.1
  Top 0.381: 46.99,47.16 R20.2
IBB_P
  Top 0.152: R4.2 36.54,37.12 36.83,36.83
  Top 0.254: U3.15 38.35,35.3 38.35,35.31 38.1,35.56
  Top 0.356: 38.1,35.56 36.83,36.83 29.21,44.45 29.21,46.99 | IBBP.P$1 29.21,46.99 | R21.1 29.21,46.99
IFL_N  (via drill 0.25)
  Top 0.203: U3.16 37.85,34.69 v37.67,34.87
  Bottom 0.203: v37.67,34.87 37.67,36.6 38,36.93 38.23,37.16 38.33,37.26 38.91,37.26 39.26,37.6 C11.2
IFL_P  (via drill 0.25)
  Top 0.203: v37.13,35.28 37.11,35.28 37.11,34.77 37.34,34.54 37.34,33.76 U3.17
  Bottom 0.203: C11.1 37.55,37.33 37.13,36.91 v37.13,35.28
IN_N
  Top 0.356: J2.P$1 5.3,12.7 arc-45 7.09,11.96 10.69,8.36 arc45 12.48,7.62 15.42,7.62 arc45 17.22,8.36 H2.8
IN_P
  Top 0.356: H1.8 8.87,44.94 arc45 8.13,43.14 8.13,40.12 arc-45 7.38,38.33 7.29,38.23 arc-45 5.49,37.49 J1.P$1
  Top 0.381: H1.8 arc45 H1.8
INI_N
  Top 0.127: U3.21 35.1,32 arc-52 33.6,32.74
  Top 0.254: C1.P$2 arc-45 33.6,32.75 33.6,32.74
INI_P
  Top 0.127: U3.20 35.46,32.51 arc39 35.15,32.41 arc-166 34.85,32.72 arc57 34.9,33.02 arc49 C2.P$2
INQ_N
  Top 0.127: U3.22 35.1,31.5 arc52 33.6,30.76 33.58,30.74 C6.P$2
INQ_P
  Top 0.127: U3.23 35.46,30.99 arc-39 35.15,31.09 arc166 34.85,30.79 arc-57 34.9,30.48 arc-49 C5.P$2
N$1
  Top 0.508: R11.1 39.57,51.87 R15.1
N$2
  Top 0.508: R11.3 34.42,51.94 R14.2
N$3
  Top 1.016: R11.2 38.05,50.75 38.05,45.72 | 38.05,45.72 C15.1 | J4.1 38.05,45.72 | J5.2 38.08,45.7 38.05,45.72
N$5
  Top 0.152: R21.2 33.02,46.99 33.2,46.81 J4.2
N$6
  cutout Route2: 16.81,22.63 26.57,12.88 26.7,12.88 23.93,10.11 23.93,10.03 14.17,19.79 14.17,19.86
N$7
  cutout Route2: 22.99,52.27 14.58,43.86 14.58,43.61 17.08,41.11 26.1,50.13 23.95,52.27
N$8
  Top 0.152: J5.1 43.03,46.33 43.69,46.99 R20.1
N$9
  Top 0.152: R17.2 31.75,16.51 32.26,16 33.02,16 33.33,16.31 J6.1
N$11
  Top 0.152: J7.2 42.85,16.33 43.18,16 43.69,16 44.2,16.51 R18.1
N$13
  Top 0.305: 38.05,12.75 R10.2 | 38.02,16.68 38.09,16.61
  Top 0.356: 38.09,16.61 38.09,16.58 38.05,16.54
  Top 1.016: 38.05,16.54 38.05,12.75 | 38.02,16.68 38.02,17.3 | 38.02,17.3 C16.1 | 38.02,17.3 38,17.27 J6.2 | J7.1 38.1,17.22 38.02,17.3
N$15
  Top 0.508: R10.3 40.64,9.33 R12.2
N$16
  Top 0.508: R10.1 35.56,9.38 R13.1
N$20
  Top 0.356: C18.2 L1.5
N$21
  Top 0.356: C17.2 L1.4
N$22
  Top 0.356: L1.3 J3.P$1
N$24
  Top 0.356: DSOP.P$1 58.42,48.26 57.15,46.99 57.15,40.64 55.88,39.37 S1.2
QBB_N
  Top 0.254: U3.5 38.85,28.21 39.12,27.94
  Top 0.356: 46.99,16.5 R18.2 46.84,16.52 46.99,16.52 | 46.99,16.52 46.99,20.07 45.21,21.84 arc90 44.74,21.84 arc-90 44.26,21.84 43.03,23.07 arc-90 43.03,23.55 arc90 43.03,24.03 41.4,25.65 | 46.99,16.52 QBBM.P$1 | 39.12,27.94 41.4,25.65 | R3.2 41.44,25.62 41.4,25.65
QBB_P
  Top 0.254: U3.4 38.35,28.19 38.1,27.94
  Top 0.356: 29.21,16.51 R17.1 29.22,16.66 | QBBP.P$1 29.21,16.51 | 29.21,16.51 29.21,19.05 35.88,25.72 | 35.88,25.72 38.1,27.94 | R1.2 35.82,25.72 35.88,25.72
QFL_N  (via drill 0.25)
  Top 0.203: U3.3 37.85,28.93 37.64,28.73 v37.64,28.68
  Bottom 0.203: v37.64,28.68 37.97,28.35 37.97,27.03 38.33,26.67 39.22,26.67 39.41,26.48 C12.2
QFL_P  (via drill 0.25)
  Top 0.203: U3.2 37.35,29.04 37.19,28.88 37.19,28.27 37.29,28.17 v37.31,28.19
  Bottom 0.203: v37.31,28.19 37.63,27.88 37.63,25.96 C12.1
RFINI_N
  Top 0.127: 32.63,33.68 R2.P$2
  Top 0.254: C1.P$1 32.63,33.68 | R2.P$2 31.07,35.25 31.07,35.8 24.19,42.67 24,42.67
  Top 0.356: H1.5 18.63,43.42 arc45 20.43,42.67 24,42.67
RFINI_P
  Top 0.127: R23.P$2 C2.P$1
  Top 0.254: R23.P$2 31.88,36.07 31.33,36.07 24.51,42.89 24.51,43.05 | H1.4 23.53,48.76
  Top 0.356: 23.53,48.76 23.77,48.52 arc-45 24.51,46.73 24.51,43.05
RFINQ_N
  Top 0.127: 31.7,28.83 31.91,29.06 | 31.91,29.06 C6.P$1 | 31.91,29.06 31.87,29.06 R22.P$2
  Top 0.254: 31.7,28.83 31.09,28.22 31.09,27.68 24.24,20.83 24,20.83
  Top 0.356: 24,20.83 20.41,20.83 arc45 18.61,20.08 18.38,19.85 H2.4
RFINQ_P
  Top 0.127: C5.P$1 32.7,28.25 R24.P$2 | R24.P$2 | R24.P$2 32.41,27.96 32.41,27.91
  Top 0.254: 32.41,27.91 31.91,27.41 31.36,27.41 24.51,20.56 24.51,20.32 | H2.5 | H2.5 23.49,14.72
  Top 0.356: 23.49,14.72 23.77,15 arc45 24.51,16.8 24.51,20.32
RFO_N
  Top 0.152: C18.1 43.8,34.66 44.2,35.05 45.12,35.05
  Top 0.254: U3.10 41.14,32 41.4,32.26
  Top 0.356: 41.4,32.26 42.16,33.02 C18.1
  Top 0.381: 45.12,35.05 L4.2
RFO_P
  Top 0.152: C17.1 43.8,28.84 44.2,28.45 45.12,28.45
  Top 0.254: U3.9 41.14,31.5 41.4,31.24
  Top 0.356: 41.4,31.24 42.16,30.48 C17.1
  Top 0.381: 45.12,28.45 L3.2
V+
  Top 0.508: U2.2 36.98,6.25 36.73,6.5 35.87,6.5 35.51,6.86 R13.2
VCC  (via drill 0.35)
  Top 0.203: U3.18 36.85,34.35 36.4,34.8 C4.P$1 36.4,34.39 v36.45,34.34 | U3.1 36.85,29.2 36.45,28.8 C3.P$1 36.45,29.01 v36.6,29.16 | U3.6 39.35,29.25 39.9,28.7 C9.P$1 39.9,29.01 v39.75,29.01 | v36.98,56.97 37.21,57.2 U1.1
  Top 0.406: L3.1 v45.21,26.11 C7.P$1 | C8.P$1 45.21,37.44 v45.24,37.41 45.24,36.69 L4.1
  Top 0.508: U1.1 37.21,57.17 36.85,56.82 C13.1 | U2.1 38.86,6.25 38.61,6.5 38.38,6.5 38.18,6.71 C21.1 38.18,6.68 v38.28,6.58
  pour Route15: 29.21,62.23 60.96,62.23 62.23,60.96 62.23,2.54 60.96,1.27 30.48,1.27 29.21,2.54 29.21,60.96

### Text on the board
tNames: RFIN_I | ADL5390 | Vector Multiplier Board | GND | RFIN_Q | +5 V
Document: 12 mils spacing / 14 mils traces gives 50 Ohm